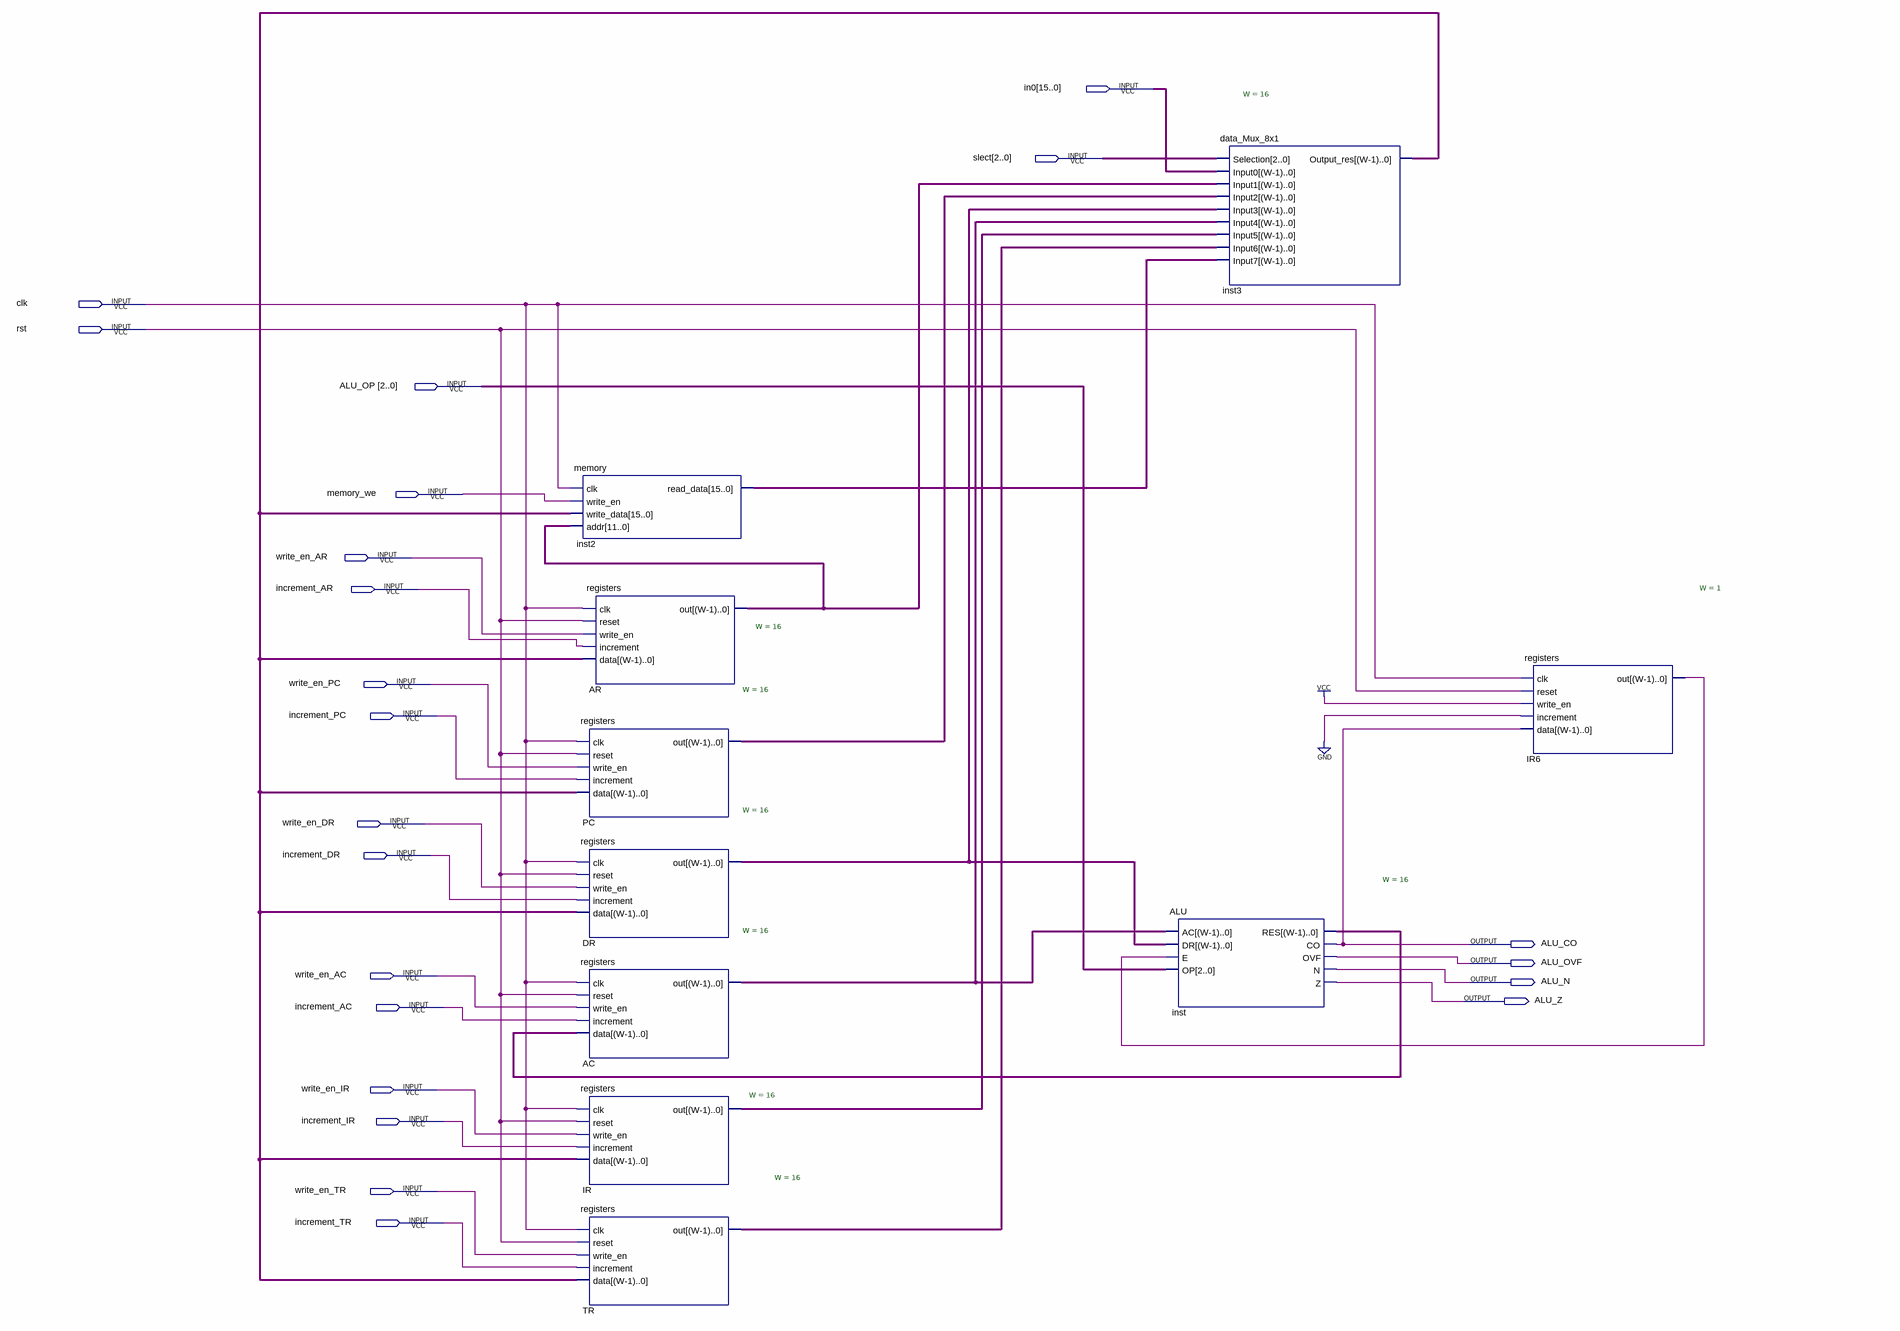
[diagram p0: schematic sheet]
// Quartus schematic basiccomputerdatapath.bdf as structural Verilog: 10 symbols, 22 pins
module basiccomputerdatapath (
  input  [15:0] in0,
  input  [2:0] slect,
  input  clk,
  input  rst,
  input  [2:0] ALU_OP,
  input  memory_we,
  input  write_en_AR,
  input  increment_AR,
  input  write_en_PC,
  input  increment_PC,
  input  write_en_DR,
  input  increment_DR,
  input  write_en_AC,
  input  increment_AC,
  input  write_en_IR,
  input  increment_IR,
  input  write_en_TR,
  input  increment_TR,
  output ALU_CO,
  output ALU_OVF,
  output ALU_N,
  output ALU_Z
);

  wire IR6_out;
  wire [15:0] AC_out, arg, DR_out, inst2_read_data, inst3_output_res, inst_res, IR_out, PC_out, TR_out;

  memory inst2 (
    .clk(clk), .write_en(memory_we), .write_data(inst3_output_res), .addr(arg[11:0]),
    .read_data(inst2_read_data));
  registers #(.W(16)) PC (
    .clk(clk), .reset(rst), .write_en(write_en_PC), .increment(increment_PC), .data(inst3_output_res),
    .out(PC_out));
  registers #(.W(16)) DR (
    .clk(clk), .reset(rst), .write_en(write_en_DR), .increment(increment_DR), .data(inst3_output_res),
    .out(DR_out));
  registers #(.W(16)) AC (
    .clk(clk), .reset(rst), .write_en(write_en_AC), .increment(increment_AC), .data(inst_res), .out(AC_out));
  registers #(.W(16)) IR (
    .clk(clk), .reset(rst), .write_en(write_en_IR), .increment(increment_IR), .data(inst3_output_res),
    .out(IR_out));
  registers #(.W(16)) TR (
    .clk(clk), .reset(rst), .write_en(write_en_TR), .increment(increment_TR), .data(inst3_output_res),
    .out(TR_out));
  registers #(.W(16)) AR (
    .clk(clk), .reset(rst), .write_en(write_en_AR), .increment(increment_AR), .data(inst3_output_res),
    .out(arg));
  ALU #(.W(16)) inst (
    .AC(AC_out), .DR(DR_out), .E(IR6_out), .OP(ALU_OP), .RES(inst_res), .CO(ALU_CO), .OVF(ALU_OVF),
    .N(ALU_N), .Z(ALU_Z));
  data_Mux_8x1 #(.W(16)) inst3 (
    .Selection(slect), .Input0(in0), .Input1(arg), .Input2(PC_out), .Input3(DR_out), .Input4(AC_out),
    .Input5(IR_out), .Input6(TR_out), .Input7(inst2_read_data), .Output_res(inst3_output_res));
  registers #(.W(1)) IR6 (.clk(clk), .reset(rst), .write_en(1'b1), .increment(1'b0), .data(ALU_CO), .out(IR6_out));
endmodule
